# Altium schematic sheet 01-Cover.SchDoc: Cover Page
size A2; DocumentNumber: 1; SheetNumber: 1; SheetTotal: 15
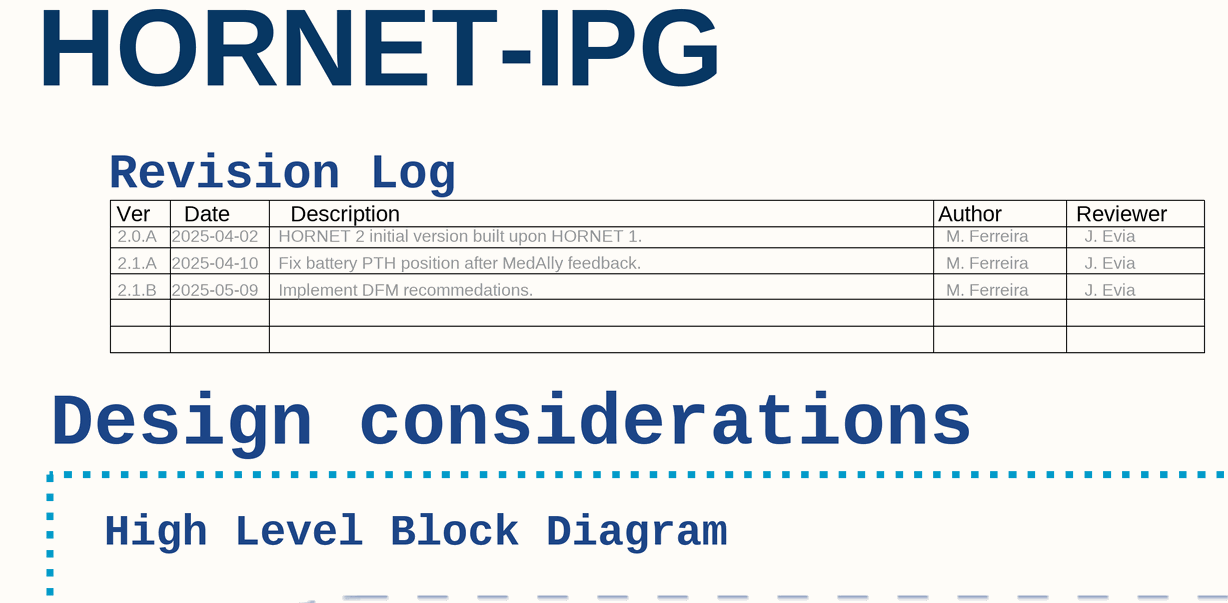
[diagram p0: 01-Cover.SchDoc, top left]
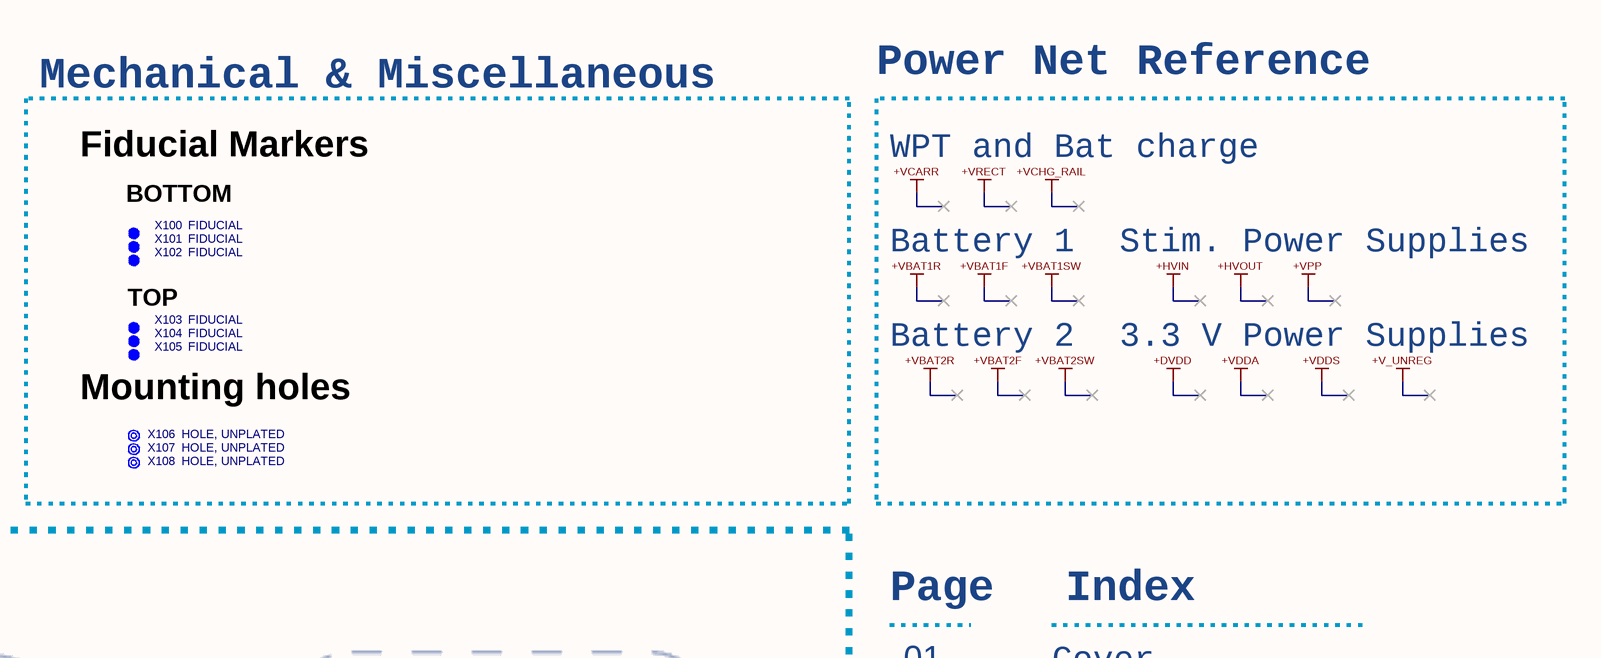
[diagram p1: 01-Cover.SchDoc, top right]
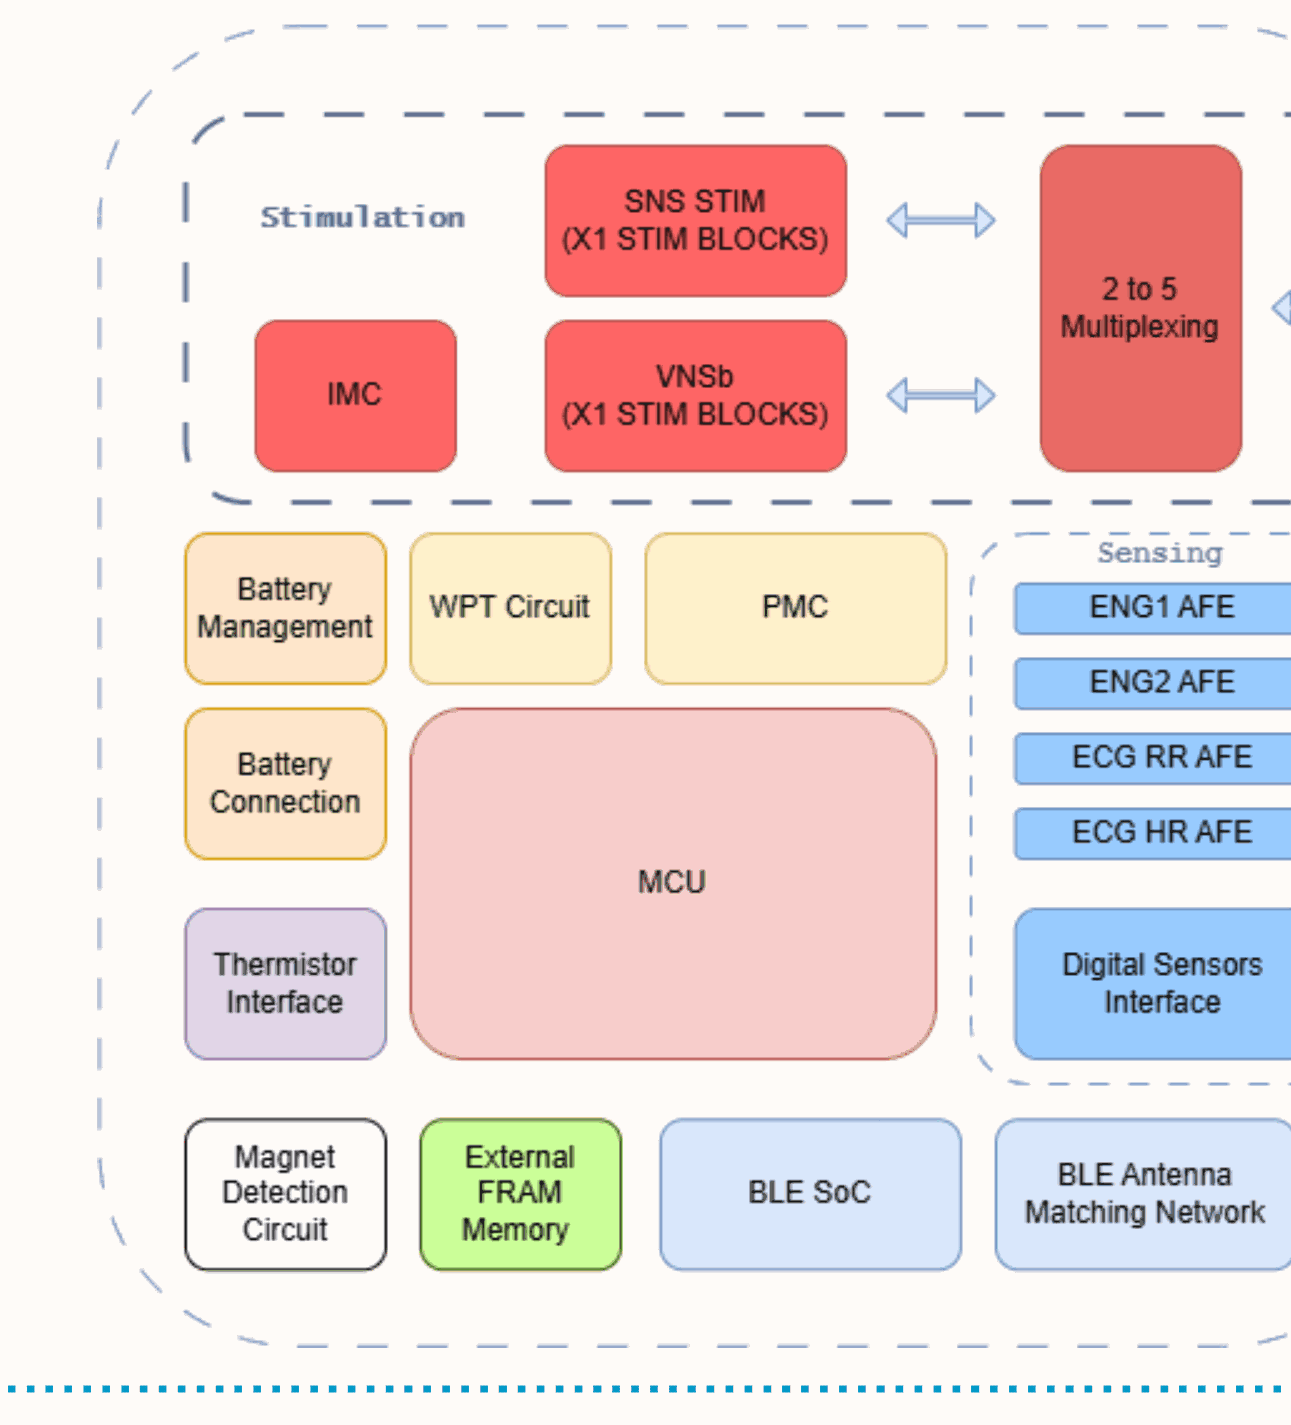
[diagram p2: 01-Cover.SchDoc, bottom left]
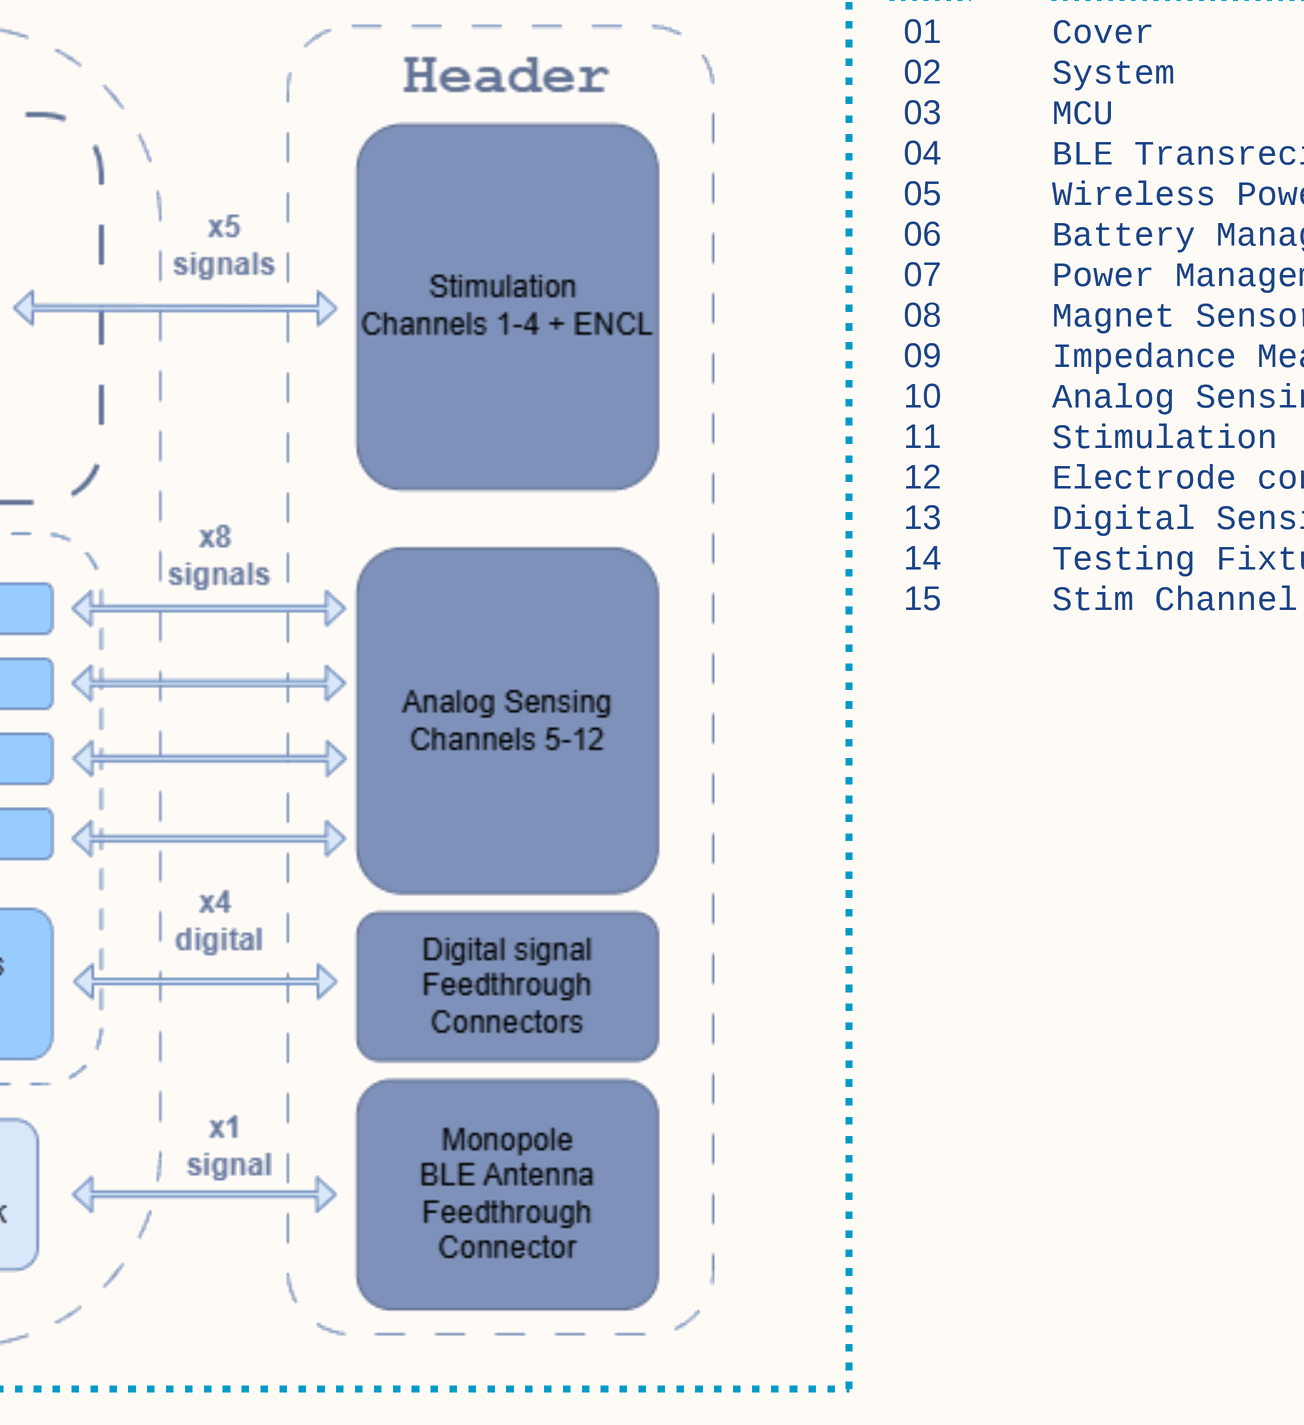
[diagram p3: 01-Cover.SchDoc, bottom right]

## Parts
X100  FIDUCIAL  [Fid_IPC-7351B]  (no BOM)
X101  FIDUCIAL  [Fid_IPC-7351B]  (no BOM)
X102  FIDUCIAL  [Fid_IPC-7351B]  (no BOM)
X103  FIDUCIAL  [Fid_IPC-7351B]  (no BOM)
X104  FIDUCIAL  [Fid_IPC-7351B]  (no BOM)
X105  FIDUCIAL  [Fid_IPC-7351B]  (no BOM)
X106  HOLE, UNPLATED  [HOLE_UNPLATED_3.5MM]  (no BOM)
X107  HOLE, UNPLATED  [HOLE_UNPLATED_3.5MM]  (no BOM)
X108  HOLE, UNPLATED  [HOLE_UNPLATED_3.5MM]  (no BOM)

## Sub-sheets
U_System = 02-System.SchDoc: no entries

## Notes on the sheet
- Power Net Reference
- Mechanical & Miscellaneous
- HORNET-IPG
- Fiducial Markers
- BOTTOM
- WPT and Bat charge
- Revision Log
- Ver
- Date
- Description
- Author
- Reviewer
- Battery 1
- Stim. Power Supplies
- 2.0.A
- 2.1.A
- 2.1.B
- 2025-04-02
- 2025-04-10
- 2025-05-09
- HORNET 2 initial version built upon HORNET 1.
- Fix battery PTH position after MedAlly feedback.
- Implement DFM recommedations.
- M. Ferreira
- J. Evia
- TOP
- Battery 2
- 3.3 V Power Supplies
- (near X105) Mounting holes
- Design considerations
- High Level Block Diagram
- Page
- Index
- 01
- Cover
- 02
- 03
- System
- MCU
- 04
- BLE Transreciver
- 05
- 06
- Wireless Power Transfer
- Battery Management
- 07
- 08
- Power Management
- Magnet Sensor
- 09
- Impedance Meas. circuit
- 10
- 11
- Analog Sensing
- Stimulation
- 12
- 13
- Electrode connections
- Digital Sensing
- 14
- Testing Fixture
- 15
- Stim Channel Selection
- Project:
- Schematic:
- Design by:
- Date:
- Ver:
- .
- Comments:
- Reviewed by:

## Library data of the parts
X100-X105 = FIDUCIAL: FIDUCIAL_MARK; Manufacturer PN: FIDUCIAL; Status: *; Review: *
X106-X108 = HOLE_UNPLATED: Status: *; Review: *